# Altium schematic sheet Control_Board.SchDoc
size A4
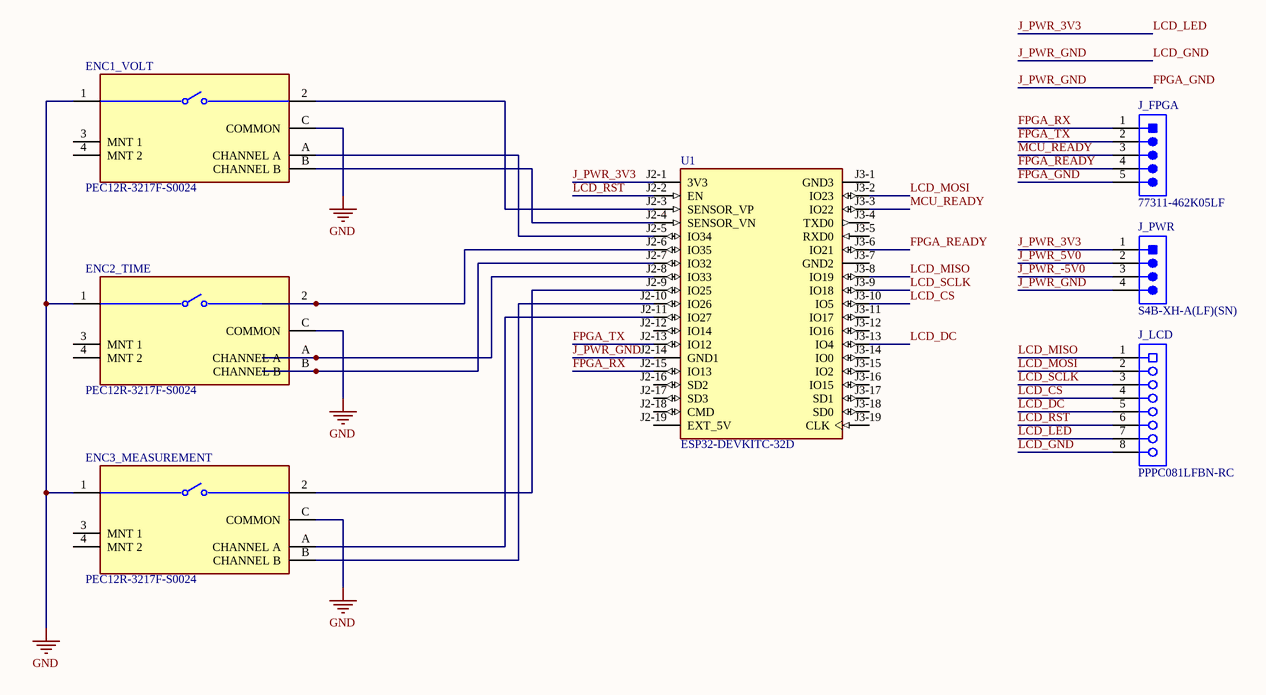
[diagram p0: Control_Board.SchDoc]

## Parts
ENC1_VOLT  PEC12R-3217F-S0024  [FP-PEC12R-3217F-S0024-MFG]
ENC2_TIME  PEC12R-3217F-S0024  [FP-PEC12R-3217F-S0024-MFG]
ENC3_MEASUREMENT  PEC12R-3217F-S0024  [FP-PEC12R-3217F-S0024-MFG]
J_FPGA  77311-462K05LF  [FCI-77311-5_V]
J_LCD  PPPC081LFBN-RC  [SLIN-PPPC081LFBN-RC_V]
J_PWR  S4B-XH-A(LF)(SN)  [JST-S4B-XH-A(LF)(SN)_V]
U1  ESP32-DEVKITC-32D  [MODULE_ESP32-DEVKITC-32D]

## Nets
GND: ENC1_VOLT.1 ENC1_VOLT.C(COMMON) ENC2_TIME.1 ENC2_TIME.C(COMMON) ENC3_MEASUREMENT.1 ENC3_MEASUREMENT.C(COMMON)
FPGA_GND: J_FPGA.5(CTS) J_LCD.8 J_PWR.4 U1.J2-14(GND1)  [also labelled J_PWR_GND, LCD_GND]
FPGA_READY: J_FPGA.4(VCC) U1.J3-6(IO21)
FPGA_RX: J_FPGA.1(DTR) U1.J2-15(IO13)
FPGA_TX: J_FPGA.2(RXI) U1.J2-13(IO12)
J_PWR_3V3: J_LCD.7 J_PWR.1 U1.J2-1(3V3)  [also labelled LCD_LED]
J_PWR_5V0: J_PWR.2
J_PWR_-5V0: J_PWR.3
LCD_CS: J_LCD.4 U1.J3-10(IO5)
LCD_DC: J_LCD.5 U1.J3-13(IO4)
LCD_MISO: J_LCD.1 U1.J3-8(IO19)
LCD_MOSI: J_LCD.2 U1.J3-2(IO23)
LCD_RST: J_LCD.6 U1.J2-2(EN)
LCD_SCLK: J_LCD.3 U1.J3-9(IO18)
MCU_READY: J_FPGA.3(TXO) U1.J3-3(IO22)
NetENC1_VOLT_2: ENC1_VOLT.2 U1.J2-3(SENSOR_VP)
NetENC1_VOLT_A: ENC1_VOLT.A(CHANNEL_A) U1.J2-5(IO34)
NetENC1_VOLT_B: ENC1_VOLT.B(CHANNEL_B) U1.J2-4(SENSOR_VN)
NetENC2_TIME_2: ENC2_TIME.2 U1.J2-6(IO35)
NetENC2_TIME_A: ENC2_TIME.A(CHANNEL_A) U1.J2-8(IO33)
NetENC2_TIME_B: ENC2_TIME.B(CHANNEL_B) U1.J2-7(IO32)
NetENC3_MEASUREMENT_2: ENC3_MEASUREMENT.2 U1.J2-9(IO25)
NetENC3_MEASUREMENT_A: ENC3_MEASUREMENT.A(CHANNEL_A) U1.J2-11(IO27)
NetENC3_MEASUREMENT_B: ENC3_MEASUREMENT.B(CHANNEL_B) U1.J2-10(IO26)

Not connected (* = marked no-connect by the designer): ENC1_VOLT 3(MNT_1) 4(MNT_2); ENC2_TIME 3(MNT_1) 4(MNT_2); ENC3_MEASUREMENT 3(MNT_1) 4(MNT_2); U1 J2-12(IO14) J2-16(SD2) J2-17(SD3) J2-18(CMD) J2-19(EXT_5V) J3-1(GND3) J3-4(TXD0) J3-5(RXD0) J3-7(GND2) J3-11(IO17) J3-12(IO16) J3-14(IO0) J3-15(IO2) J3-16(IO15) J3-17(SD1) J3-18(SD0) J3-19(CLK)

## Library data of the parts
ENC1_VOLT ENC2_TIME ENC3_MEASUREMENT = CMP-07421-000063-1: ROTARY ENCODER; Height: 13.4mm; Width: 12.5mm; Length: 23mm; RoHS Compliant: Yes
J_FPGA = CMP-002-00021-2: Male Header, Pitch 2.54 mm, 1 x 5 Position, Height 16.24 mm, Tail Length 3.05 mm, -65 to 125 degC, RoHS, Tape and Reel; Manufacturer: FCI Electronics; Connector Type: Header; Manufacturer URL: http://portal.fciconnect.com/; Datasheet URL: http://portal.fciconnect.com/Comergent//fci/drawing/77311.pdf; Gender: Male; Case/Package: 77311-5; Package Reference: 77311-5; Datasheet Version: Rev. CK, 07/2016; Package Description: Male Header, Pitch 2.54 mm, 1 x 5 Position, Height 16.24 mm, Tail Length 3.05 mm; RoHS Compliant: Unknown; Mounting Technology: TH
J_LCD = CMP-002-00028-2: Female Header, Pitch 2.54 mm, 1 x 8 Position, Height 8.5 mm, Tail Length 3.2 mm, -40 to 105 degC, RoHS, Bulk; Manufacturer: Sullins; Package Reference: PPPC081LFBN-RC; Connector Type: Header; Datasheet Version: Jan-15; Package Description: Female Header, Pitch 2.54 mm, 1 x 8 Position, Height 8.5 mm, Tail Length 3.2 mm; RoHS Compliant: Unknown; Max Operating Temperature: 105°C; Case/Package: PPPC081LFBN-RC; Min Operating Temperature: -40°C; Datasheet URL: http://sullinscorp.com/catalogs/101_PAGE114-115_.100_FEMALE_HDR.pdf; Gender: Female; Mounting Technology: TH
J_PWR = CMP-002-00034-2: Male Header, Pitch 2.5 mm, 1 x 4 Position, Height 6.1 mm, Tail Length 3.4 mm, -25 to 85 degC, RoHS, Bulk; Manufacturer: JST; Manufacturer URL: http://www.jst.com/home2.html; RoHS Compliant: Unknown; Gender: Male; Min Operating Temperature: -25°C; Datasheet URL: http://www.jst-mfg.com/product/pdf/eng/eXH.pdf; Case/Package: S4B-XH-A(LF)(SN); Datasheet Version: May-16; Mounting Technology: TH; Package Reference: S4B-XH-A(LF)(SN); Max Operating Temperature: 85°C; Package Description: XH Series Disconnectable Crimp Style Connector, Pitch 2.5 mm, 1 x 4 Position, Height 6.1 mm, Tail Length 3.4 mm; Connector Type: Header
U1 = CMP-003-000000-1: WiFi Development Tools (802.11) ESP32 General Development Kit, ESP32-WROOM-32D on the board; MF: Espressif Systems; SnapEDA_Link: https://www.snapeda.com/parts/ESP32-DEVKITC-32D/Espressif+Systems/view-part/?ref=snap; Pin Count: 38; Design Item ID: ESP32-DEVKITC-32D; Component Type: Standard; Source: ESP32-DEVKITC-32D.SchLib; Package: None; MP: ESP32-DEVKITC-32D; Value: *; Check_prices: https://www.snapeda.com/parts/ESP32-DEVKITC-32D/Espressif+Systems/view-part/?ref=eda